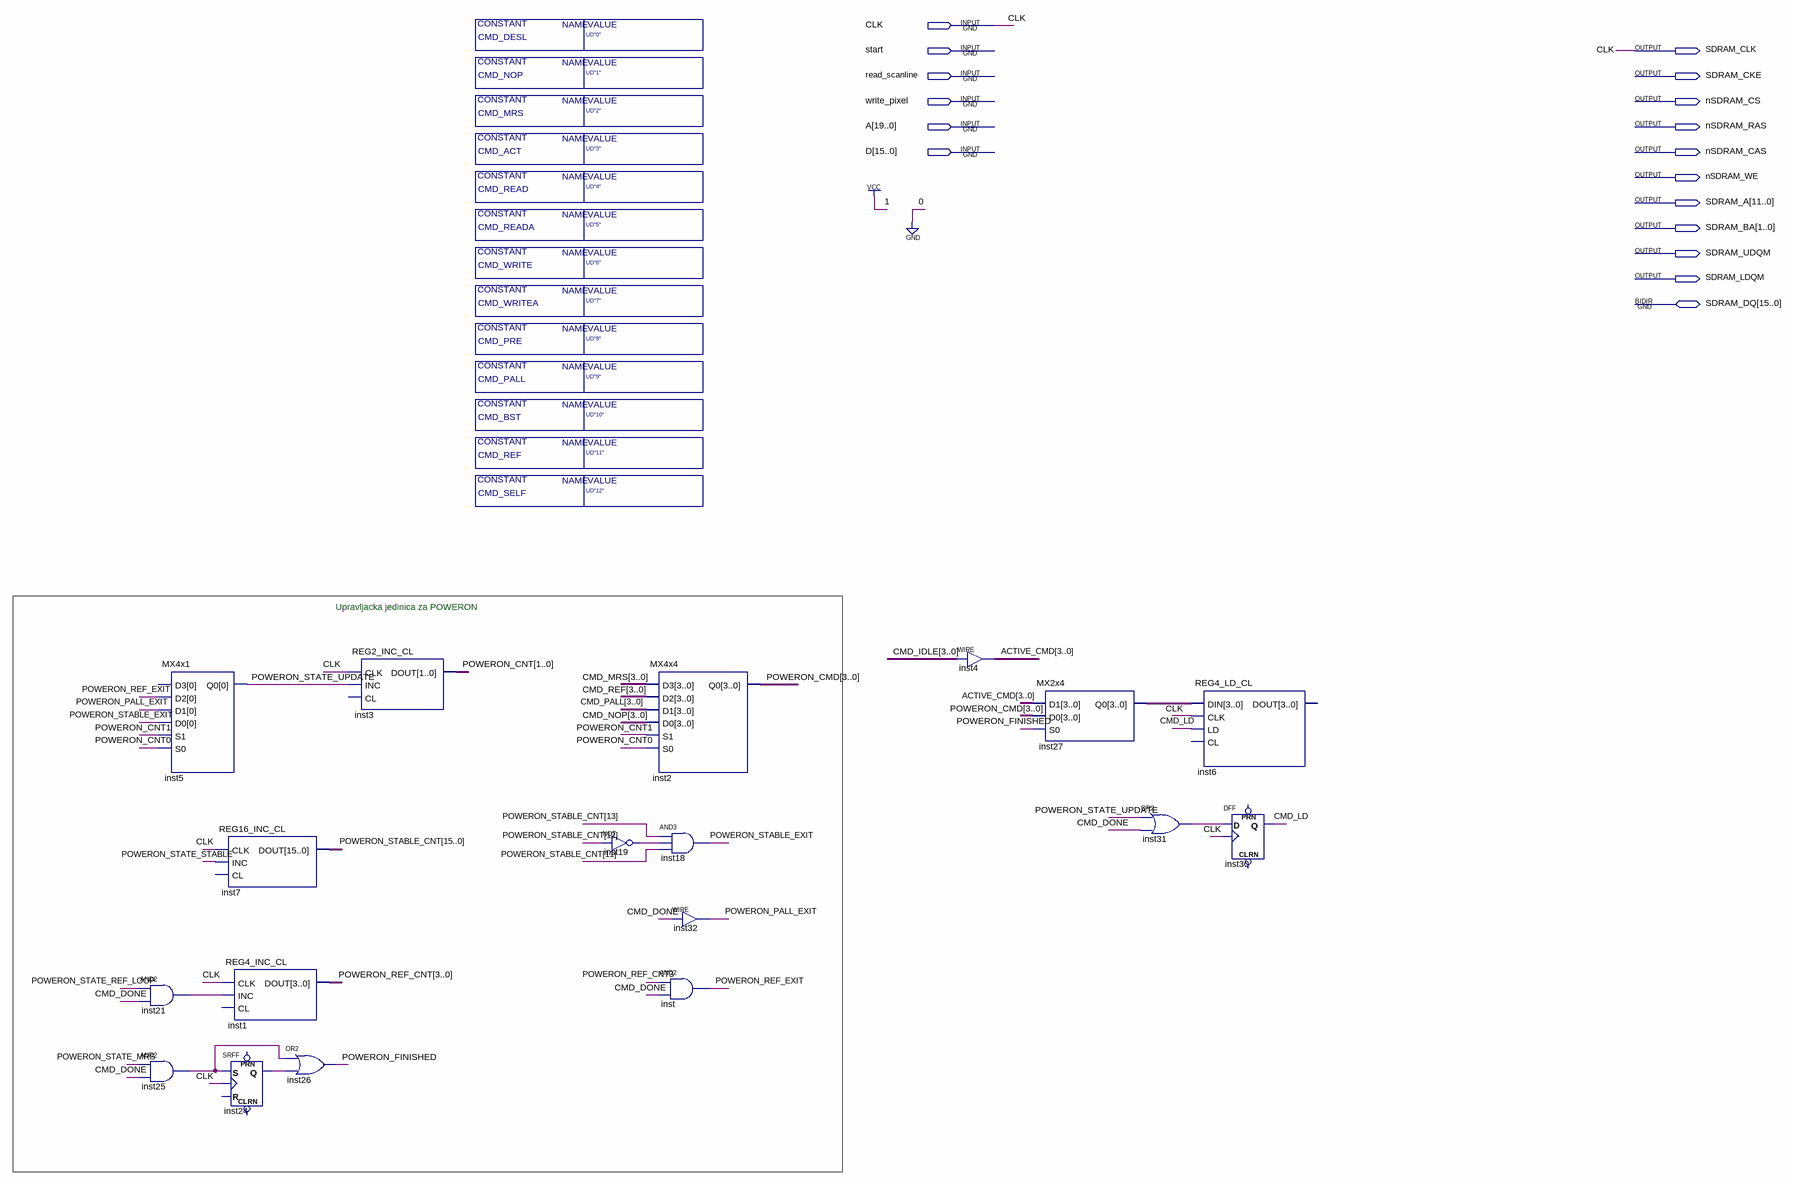
[diagram p0: schematic sheet]
// Quartus schematic vram-controller.bdf as structural Verilog: 18 symbols, 17 pins
module \vram-controller  #(parameter CMD_REF = "UD\"11\"", parameter CMD_SELF = "UD\"12\"", parameter CMD_BST = "UD\"10\"", parameter CMD_PALL = "UD\"9\"", parameter CMD_PRE = "UD\"8\"", parameter CMD_WRITEA = "UD\"7\"", parameter CMD_WRITE = "UD\"6\"", parameter CMD_READA = "UD\"5\"", parameter CMD_READ = "UD\"4\"", parameter CMD_ACT = "UD\"3\"", parameter CMD_MRS = "UD\"2\"", parameter CMD_NOP = "UD\"1\"", parameter CMD_DESL = "UD\"0\"") (
  input  CLK,
  input  start,
  input  read_scanline,
  input  write_pixel,
  input  [19:0] A,
  input  [15:0] D,
  inout  [15:0] SDRAM_DQ,
  output SDRAM_CLK,
  output SDRAM_CKE,
  output nSDRAM_CS,
  output nSDRAM_RAS,
  output nSDRAM_CAS,
  output nSDRAM_WE,
  output [11:0] SDRAM_A,
  output [1:0] SDRAM_BA,
  output SDRAM_UDQM,
  output SDRAM_LDQM
);

  wire CMD_DONE, CMD_LD, inst19_out, inst21_out, inst24_q, inst25_out, inst31_out, POWERON_FINISHED,
       POWERON_PALL_EXIT, POWERON_REF_EXIT, POWERON_STABLE_EXIT, POWERON_STATE_MRS, POWERON_STATE_REF_LOOP,
       POWERON_STATE_STABLE, POWERON_STATE_UPDATE;
  wire [1:0] POWERON_CNT;
  wire [3:0] ACTIVE_CMD, CMD_IDLE, CMD_MRS, CMD_NOP, CMD_PALL, CMD_REF, inst27_q0, POWERON_CMD,
       POWERON_REF_CNT;
  wire [15:0] POWERON_STABLE_CNT;

  MX4x1 inst5 (
    .D2(POWERON_REF_EXIT), .D1(POWERON_PALL_EXIT), .D0(POWERON_STABLE_EXIT), .S1(POWERON_CNT[1]),
    .S0(POWERON_CNT[0]), .Q0(POWERON_STATE_UPDATE));  // open: D3
  and inst21 (inst21_out, POWERON_STATE_REF_LOOP, CMD_DONE);
  and inst25 (inst25_out, POWERON_STATE_MRS, CMD_DONE);
  REG16_INC_CL inst7 (.CLK(CLK), .INC(POWERON_STATE_STABLE), .DOUT(POWERON_STABLE_CNT));  // open: CL
  REG4_INC_CL inst1 (.CLK(CLK), .INC(inst21_out), .DOUT(POWERON_REF_CNT));  // open: CL
  SRFF inst24 (.S(inst25_out), .CLK(CLK), .Q(inst24_q));  // open: PRN, CLRN, R
  or inst26 (POWERON_FINISHED, inst25_out, inst24_q);
  REG2_INC_CL inst3 (.CLK(CLK), .INC(POWERON_STATE_UPDATE), .DOUT(POWERON_CNT));  // open: CL
  not inst19 (inst19_out, POWERON_STABLE_CNT[12]);
  MX4x4 inst2 (
    .D3(CMD_MRS), .D2(CMD_REF), .D1(CMD_PALL), .D0(CMD_NOP), .S1(POWERON_CNT[1]), .S0(POWERON_CNT[0]),
    .Q0(POWERON_CMD));
  and inst18 (POWERON_STABLE_EXIT, POWERON_STABLE_CNT[13], inst19_out, POWERON_STABLE_CNT[11]);
  and inst (POWERON_REF_EXIT, POWERON_REF_CNT[3], CMD_DONE);
  assign POWERON_PALL_EXIT = CMD_DONE;  // WIRE inst32
  assign ACTIVE_CMD = CMD_IDLE;  // WIRE inst4
  MX2x4 inst27 (.D1(ACTIVE_CMD), .D0(POWERON_CMD), .S0(POWERON_FINISHED), .Q0(inst27_q0));
  or inst31 (inst31_out, POWERON_STATE_UPDATE, CMD_DONE);
  REG4_LD_CL inst6 (.DIN(inst27_q0), .CLK(CLK), .LD(CMD_LD));  // open: CL, DOUT
  DFF inst30 (.CLK(CLK), .D(inst31_out), .Q(CMD_LD));  // open: CLRN, PRN

  assign SDRAM_CLK = CLK;

  // Notes on the sheet:
  //   Upravljacka jedinica za POWERON
endmodule
